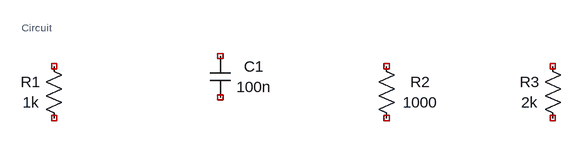
[diagram p0: schematic circuit.asc]
circuit.asc, the LTspice schematic file:
Version 4
SHEET 1 912 224
SYMBOL cap 320 128 R0
WINDOW 0 68 16 Center 2
WINDOW 3 68 48 Center 2
SYMATTR InstName C1
SYMATTR Value 100n
SYMBOL res 64 128 R0
WINDOW 0 -20 40 Center 2
WINDOW 3 -20 72 Center 2
SYMATTR InstName R1
SYMATTR Value 1k
SYMBOL res 576 128 R0
WINDOW 0 68 40 Center 2
WINDOW 3 68 72 Center 2
SYMATTR InstName R2
SYMATTR Value 1000
SYMBOL res 832 128 R0
WINDOW 0 -20 40 Center 2
WINDOW 3 -20 72 Center 2
SYMATTR InstName R3
SYMATTR Value 2k
TEXT 30 84 Left 1 ;Circuit

The netlist it stands for:
* circuit.asc
C1 NC_01 NC_02 100n
R1 NC_03 NC_04 1k
R2 NC_05 NC_06 1000
R3 NC_07 NC_08 2k
* Circuit
.backanno
.end